# EAGLE design esp_RAMPS_1_41_Stepper_drivers (EAGLE 8.7.0)
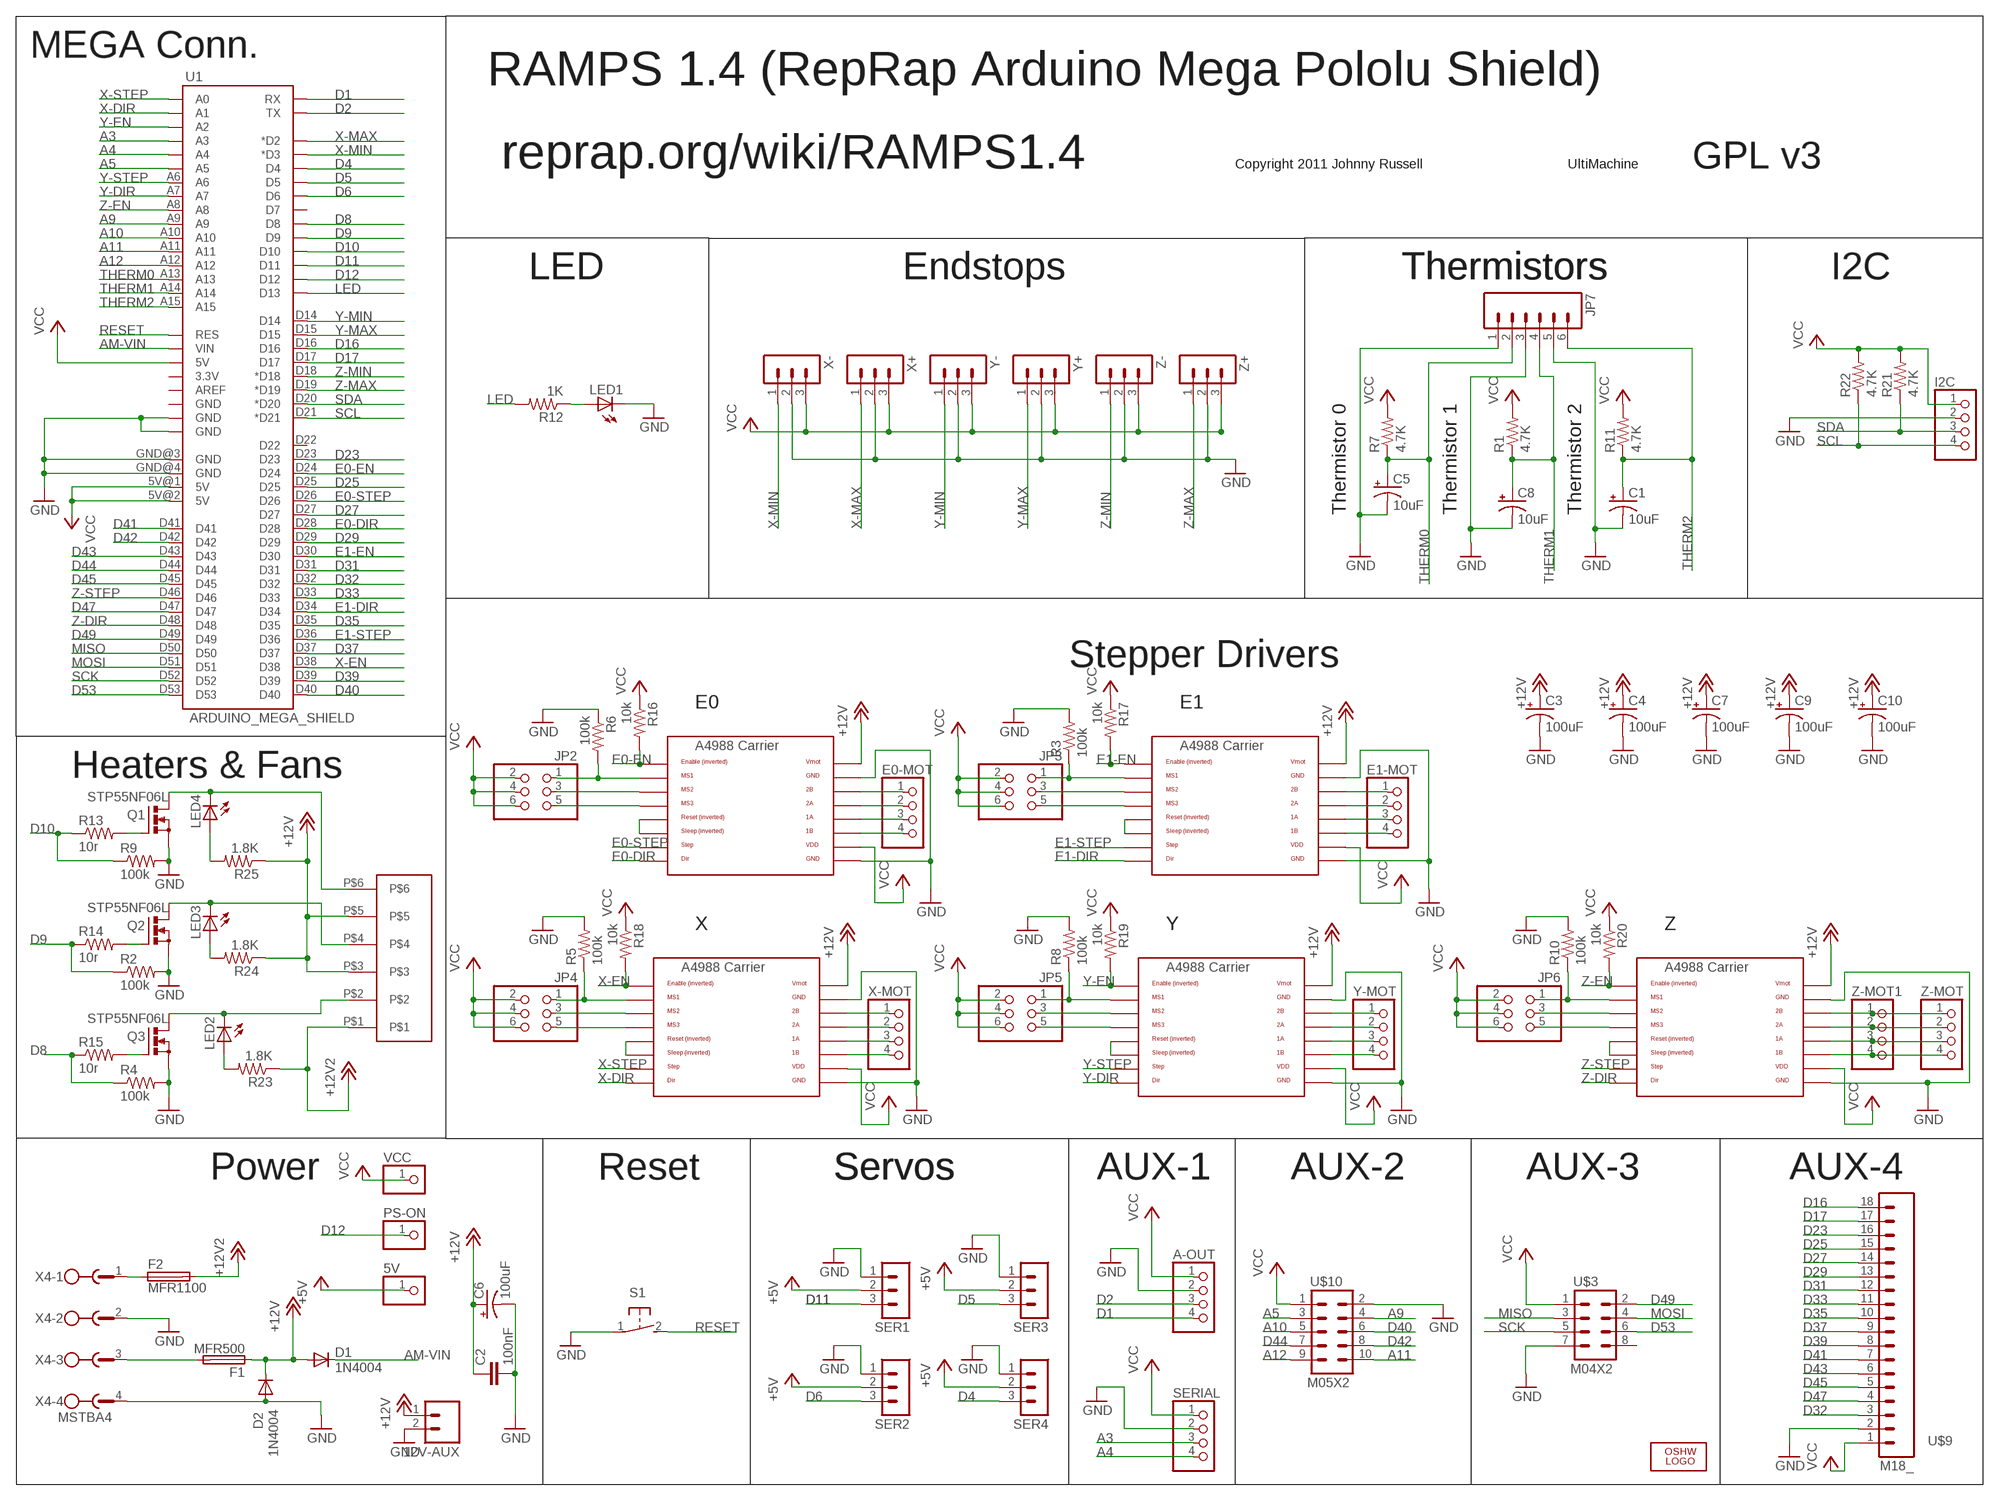
[diagram p0: schematic, sheet 1]

## Parts
5V  PINHD-1X1  [1X01]
12V-AUX  M02PTH  [1X02]
A-OUT  PINHD-1X4  [1X04]
C1  10uF  CPOL-US153CLV-0405  [153CLV-0405]
C2  100nF  C-EUC0805  [C0805]
C3  100uF  CPOL-US153CLV-0605  [153CLV-0605]
C4  100uF  CPOL-US153CLV-0605  [153CLV-0605]
C5  10uF  CPOL-US153CLV-0405  [153CLV-0405]
C6  100uF  CPOL-US153CLV-0605  [153CLV-0605]
C7  100uF  CPOL-US153CLV-0605  [153CLV-0605]
C8  10uF  CPOL-US153CLV-0405  [153CLV-0405]
C9  100uF  CPOL-US153CLV-0605  [153CLV-0605]
C10  100uF  CPOL-US153CLV-0605  [153CLV-0605]
D1  1N4004  [DO41-10]
D2  1N4004  [DO41-10]
E0-MOT  PINHD-1X4  [1X04]
E1-MOT  PINHD-1X4  [1X04]
F1  MFR500  PTCFUSE  [MFR500]
F2  MFR1100  PTCFUSEMFR1100  [MFR1100]
I2C  PINHD-1X4  [1X04]
JP2  PINHD-2X3  [2X03]
JP3  PINHD-2X3  [2X03]
JP4  PINHD-2X3  [2X03]
JP5  PINHD-2X3  [2X03]
JP6  PINHD-2X3  [2X03]
JP7  M06SIP  [1X06]
LED1  LEDCHIP-LED0805  [CHIP-LED0805]
LED2  LEDCHIP-LED0805  [CHIP-LED0805]
LED3  LEDCHIP-LED0805  [CHIP-LED0805]
LED4  LEDCHIP-LED0805  [CHIP-LED0805]
LOGO1  OSHW_LOGO_6MILX0100-NT  [OSHW_6X100_NOTEXT]
PS-ON  PINHD-1X1  [1X01]
Q1  STP55NF06L  IRF512  [TO220BV]
Q2  STP55NF06L  IRF512  [TO220BV]
Q3  STP55NF06L  IRF512  [TO220BV]
R1  4.7K  R-US_R0805  [R0805]
R2  100k  R-US_R0805  [R0805]
R3  100k  R-US_R0805  [R0805]
R4  100k  R-US_R0805  [R0805]
R5  100k  R-US_R0805  [R0805]
R6  100k  R-US_R0805  [R0805]
R7  4.7K  R-US_R0805  [R0805]
R8  100k  R-US_R0805  [R0805]
R9  100k  R-US_R0805  [R0805]
R10  100k  R-US_R0805  [R0805]
R11  4.7K  R-US_R0805  [R0805]
R12  1K  R-US_R0805  [R0805]
R13  10r  R-US_R0805  [R0805]
R14  10r  R-US_M0805  [M0805]
R15  10r  R-US_R0805  [R0805]
R16  10k  R-US_R0805  [R0805]
R17  10k  R-US_R0805  [R0805]
R18  10k  R-US_R0805  [R0805]
R19  10k  R-US_R0805  [R0805]
R20  10k  R-US_R0805  [R0805]
R21  4.7K  R-US_R0805  [R0805]
R22  4.7K  R-US_R0805  [R0805]
R23  1.8K  R-US_R0805  [R0805]
R24  1.8K  R-US_R0805  [R0805]
R25  1.8K  R-US_R0805  [R0805]
S1  31-XX  [B3F-31XX]
SER1  3PIN-HEADER  [3PIN-HEADER]
SER2  3PIN-HEADER  [3PIN-HEADER]
SER3  3PIN-HEADER  [3PIN-HEADER]
SER4  3PIN-HEADER  [3PIN-HEADER]
SERIAL  PINHD-1X4  [1X04]
U1  ARDUINO_MEGA_SHIELD  [ARDUINO_MEGA_SHIELD]
U$2  282837-6  [282837-6]
U$3  M04X2  [2X4]
U$4  A4988BREAKOUT  [A4988BREAKOUT]
U$5  A4988BREAKOUT  [A4988BREAKOUT]
U$6  A4988BREAKOUT  [A4988BREAKOUT]
U$7  A4988BREAKOUT  [A4988BREAKOUT]
U$8  A4988BREAKOUT  [A4988BREAKOUT]
U$9  M18_  [1X18]
U$10  M05X2  [2X5]
VCC  PINHD-1X1  [1X01]
X4  MSTBA4  [MSTBA4]
X+  3PIN-HEADER  [3PIN-HEADER]
X-  3PIN-HEADER  [3PIN-HEADER]
X-MOT  PINHD-1X4  [1X04]
Y+  3PIN-HEADER  [3PIN-HEADER]
Y-  3PIN-HEADER  [3PIN-HEADER]
Y-MOT  PINHD-1X4  [1X04]
Z+  3PIN-HEADER  [3PIN-HEADER]
Z-  3PIN-HEADER  [3PIN-HEADER]
Z-MOT  PINHD-1X4  [1X04]
Z-MOT1  PINHD-1X4  [1X04]

## Nets
+5V: 5V.1 SER1.2 SER2.2 SER3.2 SER4.2
+12V: 12V-AUX.1 C2.1 C3.+ C4.+ C6.+ C7.+ C9.+ C10.+ D1.A D2.C F1.1 R24.1 R25.1 U$2.P$3 U$2.P$5 U$4.VMOT U$5.VMOT U$6.VMOT U$7.VMOT U$8.VMOT
+12V2: F2.2 R23.1 U$2.P$1
A3: SERIAL.3 U1.A3
A4: SERIAL.4 U1.A4
A5: U1.A5 U$10.3
A9: U1.A9 U$10.4
A10: U1.A10 U$10.5
A11: U1.A11 U$10.10
A12: U1.A12 U$10.9
AM-VIN: D1.C U1.VIN
D1: A-OUT.4 U1.RX
D2: A-OUT.3 U1.TX
D4: SER4.3 U1.D4
D5: SER3.3 U1.D5
D6: SER2.3 U1.D6
D8: R4.1 R15.1 U1.D8
D9: R2.1 R14.1 U1.D9
D10: R9.1 R13.1 U1.D10
D11: SER1.3 U1.D11
D12: PS-ON.1 U1.D12
D16: U1.D16 U$9.18
D17: U1.D17 U$9.17
D23: U1.D23 U$9.16
D25: U1.D25 U$9.15
D27: U1.D27 U$9.14
D29: U1.D29 U$9.13
D31: U1.D31 U$9.12
D32: U1.D32 U$9.3
D33: U1.D33 U$9.11
D35: U1.D35 U$9.10
D37: U1.D37 U$9.9
D39: U1.D39 U$9.8
D40: U1.D40 U$10.6
D41: U1.D41 U$9.7
D42: U1.D42 U$10.8
D43: U1.D43 U$9.6
D44: U1.D44 U$10.7
D45: U1.D45 U$9.5
D47: U1.D47 U$9.4
D49: U1.D49 U$3.2
D53: U1.D53 U$3.6
E0-DIR: U1.D28 U$4.DIR
E0-EN: R16.2 U1.D24 U$4.EN
E0-STEP: U1.D26 U$4.STEP
E1-DIR: U1.D34 U$5.DIR
E1-EN: R17.2 U1.D30 U$5.EN
E1-STEP: U1.D36 U$5.STEP
GND: 12V-AUX.2 A-OUT.2 C1.- C2.2 C3.- C4.- C5.- C6.- C7.- C8.- C9.- C10.- D2.A I2C.2 JP7.1 JP7.3 JP7.5 LED1.C Q1.S Q2.S Q3.S R2.2 R3.2 R4.2 R5.2 R6.1 R8.2 R9.2 R10.2 S1.1(P) SER1.1 SER2.1 SER3.1 SER4.1 SERIAL.2 U1.GND@0(GND) U1.GND@1(GND) U1.GND@3(GND) U1.GND@4(GND) U$3.7 U$4.GND U$4.GND@0(GND) U$5.GND U$5.GND@0(GND) U$6.GND U$6.GND@0(GND) U$7.GND U$7.GND@0(GND) U$8.GND U$8.GND@0(GND) U$9.2 U$10.2 X4.2 X4.4 X+.2 X-.2 Y+.2 Y-.2 Z+.2 Z-.2
LED: R12.2 U1.D13
MISO: U1.D50 U$3.3
MOSI: U1.D51 U$3.4
N$1: LED3.C Q2.D U$2.P$4
N$3: E0-MOT.1 U$4.2B
N$4: E0-MOT.2 U$4.2A
N$5: JP2.1 R6.2 U$4.MS1
N$6: JP2.5 U$4.MS3
N$7: LED4.C Q1.D U$2.P$6
N$8: U$4.RST U$4.SLP(SLEEP)
N$9: JP2.3 U$4.MS2
N$10: E0-MOT.3 U$4.1A
N$11: E0-MOT.4 U$4.1B
N$12: E1-MOT.1 U$5.2B
N$13: E1-MOT.2 U$5.2A
N$14: JP4.1 R5.1 U$6.MS1
N$15: JP4.3 U$6.MS2
N$16: E1-MOT.3 U$5.1A
N$17: JP5.3 U$7.MS2
N$18: E1-MOT.4 U$5.1B
N$19: JP4.5 U$6.MS3
N$20: U$6.RST U$6.SLP(SLEEP)
N$21: U$6.2B X-MOT.1
N$22: U$6.2A X-MOT.2
N$23: U$7.RST U$7.SLP(SLEEP)
N$24: U$5.RST U$5.SLP(SLEEP)
N$25: JP3.1 R3.1 U$5.MS1
N$26: U$6.1A X-MOT.3
N$27: U$6.1B X-MOT.4
N$28: U$7.2B Y-MOT.1
N$29: U$7.2A Y-MOT.2
N$30: U$7.1A Y-MOT.3
N$31: JP5.5 U$7.MS3
N$32: LED2.A R23.2
N$33: JP5.1 R8.1 U$7.MS1
N$34: JP3.5 U$5.MS3
N$35: JP3.3 U$5.MS2
N$36: U$7.1B Y-MOT.4
N$37: JP6.3 U$8.MS2
N$38: U$8.RST U$8.SLP(SLEEP)
N$39: JP6.5 U$8.MS3
N$40: JP6.1 R10.1 U$8.MS1
N$41: U$8.2B Z-MOT1.1 Z-MOT.1
N$42: U$8.2A Z-MOT1.2 Z-MOT.2
N$43: U$8.1A Z-MOT1.3 Z-MOT.3
N$44: U$8.1B Z-MOT1.4 Z-MOT.4
N$45: LED3.A R24.2
N$46: LED1.A R12.1
N$47: Q2.G R14.2
N$48: Q1.G R13.2
N$49: Q3.G R15.2
N$50: LED4.A R25.2
N$51: LED2.C Q3.D U$2.P$2
N$53: F2.1 X4.1
N$54: F1.2 X4.3
RESET: S1.2(S) U1.RES
SCK: U1.D52 U$3.5
SCL: I2C.4 R22.1 U1.D21(*D21)
SDA: I2C.3 R21.1 U1.D20(*D20)
THERM0: C5.+ JP7.2 R7.1 U1.A13
THERM1: C8.+ JP7.4 R1.1 U1.A14
THERM2: C1.+ JP7.6 R11.1 U1.A15
VCC: A-OUT.1 I2C.1 JP2.2 JP2.4 JP2.6 JP3.2 JP3.4 JP3.6 JP4.2 JP4.4 JP4.6 JP5.2 JP5.4 JP5.6 JP6.2 JP6.4 JP6.6 R1.2 R7.2 R11.2 R16.1 R17.1 R18.1 R19.1 R20.1 R21.2 R22.2 SERIAL.1 U1.5V@0(5V) U1.5V@1(5V) U1.5V@2(5V) U$3.1 U$4.VDD U$5.VDD U$6.VDD U$7.VDD U$8.VDD U$9.1 U$10.1 VCC.1 X+.3 X-.3 Y+.3 Y-.3 Z+.3 Z-.3
X-DIR: U1.A1 U$6.DIR
X-EN: R18.2 U1.D38 U$6.EN
X-MAX: U1.D2(*D2) X+.1
X-MIN: U1.D3(*D3) X-.1
X-STEP: U1.A0 U$6.STEP
Y-DIR: U1.A7 U$7.DIR
Y-EN: R19.2 U1.A2 U$7.EN
Y-MAX: U1.D15 Y+.1
Y-MIN: U1.D14 Y-.1
Y-STEP: U1.A6 U$7.STEP
Z-DIR: U1.D48 U$8.DIR
Z-EN: R20.2 U1.A8 U$8.EN
Z-MAX: U1.D19(*D19) Z+.1
Z-MIN: U1.D18(*D18) Z-.1
Z-STEP: U1.D46 U$8.STEP
Unconnected: U1.3.3V U1.AREF U1.D7 U1.D22 U1.GND@2(GND) U$3.8

## Notes on the sheet
- MEGA Conn.
- RAMPS 1.4 (RepRap Arduino Mega Pololu Shield)
- reprap.org/wiki/RAMPS1.4 | Copyright 2011 Johnny Russell | UltiMachine | GPL v3
- LED | Endstops | Thermistors | Thermistors | I2C
- Thermistor 0 | Thermistor 1 | Thermistor 2
- Stepper Drivers
- E0 | E1
- Heaters & Fans
- X | Y | Z
- Power | Reset | Servos | Servos | AUX-1 | AUX-2 | AUX-3 | AUX-4

## Library data of the parts
5V PS-ON VCC = adafruit:PINHD-1X1: Pin header 1x1 for 0.1" spacing With round pins
12V-AUX = SparkFun:M02: Header 2 Standard 2-pin 0.1" header. Use with straight break away headers (SKU : PRT-00116), right angle break away headers (PRT-00553), swiss pins (PRT-00743), machine pins (PRT-00117), and female headers (PRT-00115). Molex polarized connector foot print use with SKU : PRT-08233 with associated crimp pins and housings.
A-OUT E0-MOT E1-MOT I2C SERIAL X-MOT Y-MOT Z-MOT Z-MOT1 = RepRapjr:PINHD-1X4: PIN HEADER
C1 C3-C10 = adafruit:CPOL-US: POLARIZED CAPACITOR, American symbol
C2 = resistor:C-EU: CAPACITOR, European symbol
D1 D2 = diode:1N4004: DIODE general purpose rectifier, 1 A
F1 F2 = RepRapjr:PTCFUSE: LITTLEFUSE Picofuse/slow Littlefuse
JP2-JP6 = pinhead:PINHD-2X3: PIN HEADER
JP7 = SparkFun:M06: Header 6 Standard 6-pin 0.1" header. Use with straight break away headers (SKU : PRT-00116), right angle break away headers (PRT-00553), swiss pins (PRT-00743), machine pins (PRT-00117), and female headers (PRT-00115). Molex polarized connector foot print use with SKU : PRT-08094 with associated crimp pins and housings. NOTES ON THE VARIANTS LOCK and LOCK_LONGPADS... This footprint was designed to help hold the alignment of a through-hole component (i.e. 6-pin header) while soldering it into place. You may notice that each hole has been shifted either up or down by 0.005 of an inch from it's more standard position (which is a perfectly straight line). This slight alteration caused the pins (the squares in the middle) to touch the edges of the holes. Because they are alternating, it causes a "brace" to hold the component in place. 0.005 has proven to be the perfect amount of "off-center" position when using our standard breakaway headers. Although looks a little odd when you look at the bare footprint, once you have a header in there, the alteration is very hard to notice. Also, if you push a header all the way into place, it is covered up entirely on the bottom side. This idea of altering the position of holes to aid alignment will be further integrated into the Sparkfun Library for other footprints. It can help hold any component with 3 or more connection pins.
LED1-LED4 = led:LED: LED OSRAM: - CHIPLED LG R971, LG N971, LY N971, LG Q971, LY Q971, LO R971, LY R971 LH N974, LH R974 LS Q976, LO Q976, LY Q976 LO Q996 - Hyper CHIPLED LW Q18S LB Q993, LB Q99A, LB R99A - SideLED LS A670, LO A670, LY A670, LG A670, LP A670 LB A673, LV A673, LT A673, LW A673 LH A674 LY A675 LS A676, LA A676, LO A676, LY A676, LW A676 LS A679, LY A679, LG A679 - Hyper Micro SIDELED® LS Y876, LA Y876, LO Y876, LY Y876 LT Y87S - SmartLED LW L88C, LW L88S LB L89C, LB L89S, LG L890 LS L89K, LO L89K, LY L89K LS L896, LA L896, LO L896, LY L896 - TOPLED LS T670, LO T670, LY T670, LG T670, LP T670 LSG T670, LSP T670, LSY T670, LOP T670, LYG T670 LG T671, LOG T671, LSG T671 LB T673, LV T673, LT T673, LW T673 LH T674 LS T676, LA T676, LO T676, LY T676, LB T676, LH T676, LSB T676, LW T676 LB T67C, LV T67C, LT T67C, LS T67K, LO T67K, LY T67K, LW E67C LS E67B, LA E67B, LO E67B, LY E67B, LB E67C, LV E67C, LT E67C LW T67C LS T679, LY T679, LG T679 LS T770, LO T770, LY T770, LG T770, LP T770 LB T773, LV T773, LT T773, LW T773 LH T774 LS E675, LA E675, LY E675, LS T675 LS T776, LA T776, LO T776, LY T776, LB T776 LHGB T686 LT T68C, LB T68C - Hyper Mini TOPLED® LB M676 - Mini TOPLED Santana® LG M470 LS M47K, LO M47K, LY M47K Source: http://www.osram.convergy.de LUXEON: - LUMILED® LXK2-PW12-R00, LXK2-PW12-S00, LXK2-PW14-U00, LXK2-PW14-V00 LXK2-PM12-R00, LXK2-PM12-S00, LXK2-PM14-U00 LXK2-PE12-Q00, LXK2-PE12-R00, LXK2-PE12-S00, LXK2-PE14-T00, LXK2-PE14-U00 LXK2-PB12-K00, LXK2-PB12-L00, LXK2-PB12-M00, LXK2-PB14-N00, LXK2-PB14-P00, LXK2-PB14-Q00 LXK2-PR12-L00, LXK2-PR12-M00, LXK2-PR14-Q00, LXK2-PR14-R00 LXK2-PD12-Q00, LXK2-PD12-R00, LXK2-PD12-S00 LXK2-PH12-R00, LXK2-PH12-S00 LXK2-PL12-P00, LXK2-PL12-Q00, LXK2-PL12-R00 Source: www.luxeon.com KINGBRIGHT: KA-3528ASYC Source: www.kingbright.com
LOGO1 = OSHW:OSHW_LOGO_6MIL
Q1-Q3 = transistor-power:IRF512: N-CHANNEL MOS FET
R1-R12 R16-R25 = adafruit:R-US_: RESISTOR, American symbol
R13-R15 = resistor:R-US_: RESISTOR, American symbol
S1 = switch-omron:31-XX: OMRON SWITCH; MPN: B3F-3100; OC_FARNELL: 959704; OC_NEWARK: 36M3582
SER1-SER4 X+ X- Y+ Y- Z+ Z- = ultimachine:3PIN-HEADER: PIN HEADER
U1 = RepRapjr:ARDUINO_MEGA_SHIELD
U$2 = RepRapjr:282837-6
U$3 = SparkFun:M04X2
U$4-U$8 = RepRapjr:A4988BREAKOUT
U$9 = SparkFun:M18
U$10 = RepRapjr:M05X2
X4 = con-phoenix-508:MSTBA4: PHOENIX

## Board
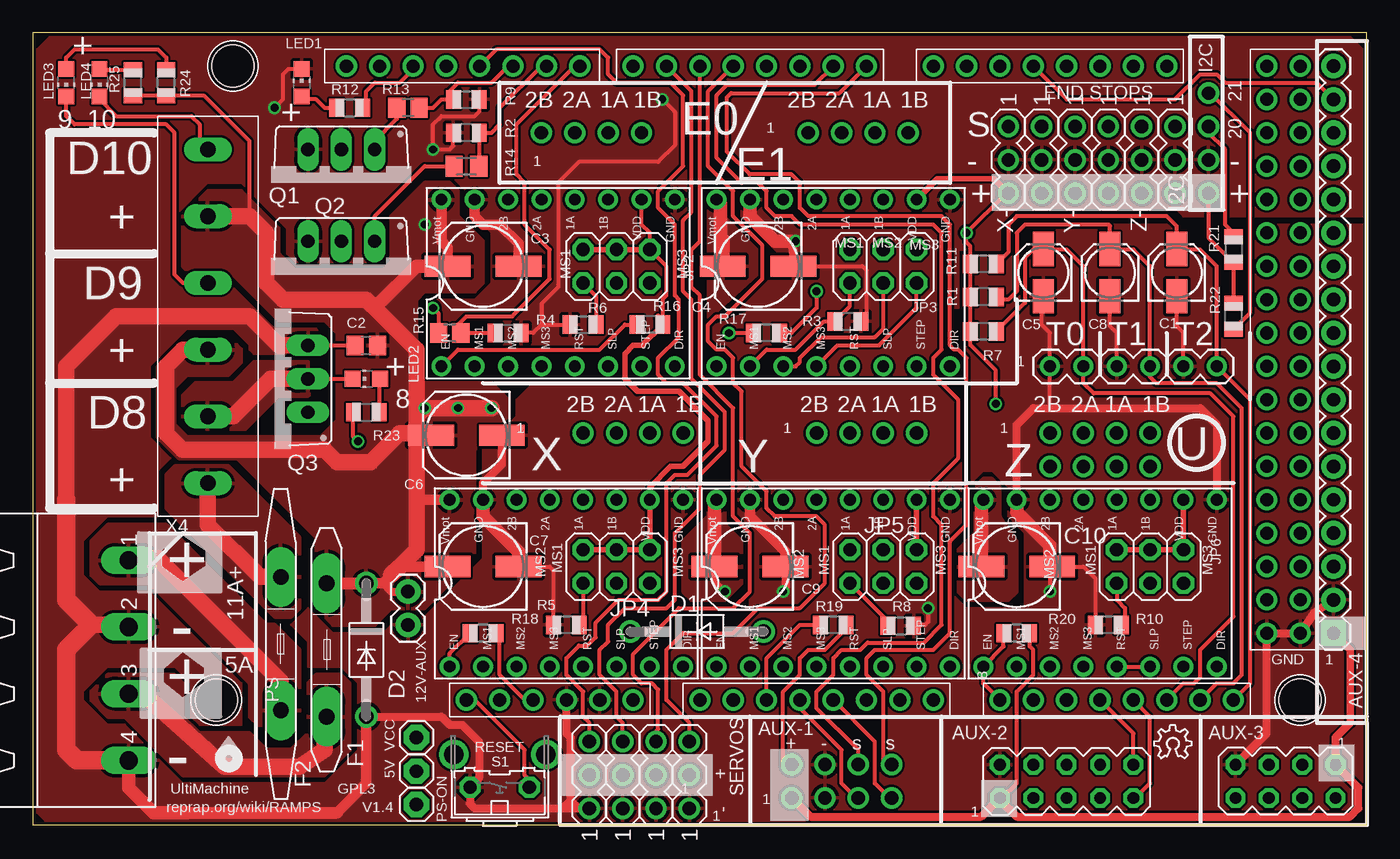
[diagram p1: board, top side]
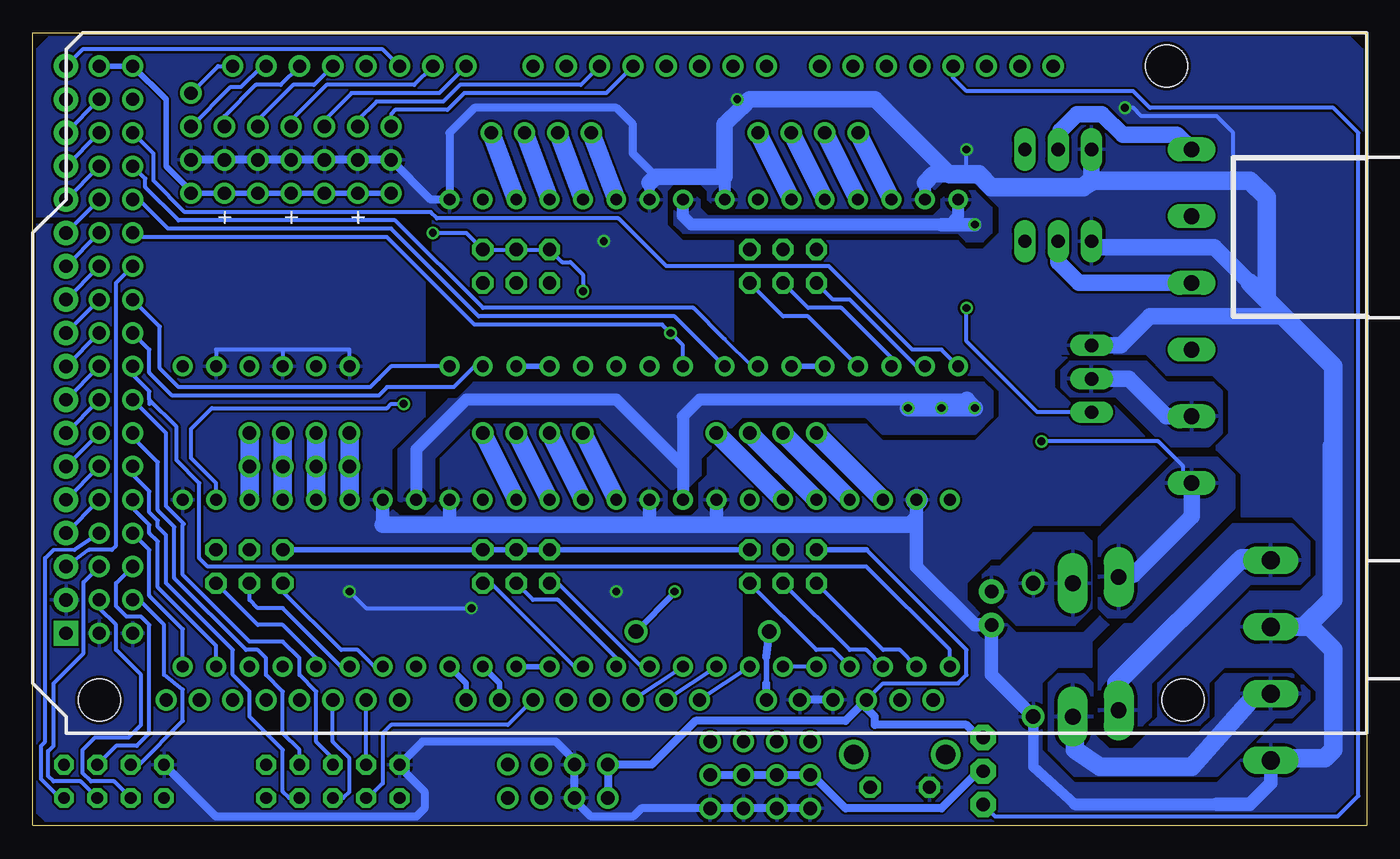
[diagram p2: board, bottom side, seen from below]

Size 101.59 x 60.31 mm. Coordinates in mm from the lower left corner, seen from the top.
Outline: 101.59,0 101.59,60.31 0,60.31 0,0 101.59,0
Copper layers (1*16): Top 0.035mm / dielectric 1.5mm / Bottom 0.035mm
Design rules "GoldPhoenix": minimum track width 7mil, minimum drill 15mil, track to track 7mil, track to pad 7mil, pad to pad 7mil, via to via 7mil, smd to smd 7mil, copper to edge 10mil, drill to drill 8mil, minimum pad ring 12mil, minimum via ring 7mil, stop-mask expansion 4mil, vias tented up to drill 25mil, thermal gap 10mil

### Footprints (pad centres in the part's own frame; a part is rotated, then mirrored left to right if it is on the bottom)
1X01 = drill 1.016 pad 1.93 octagon: 1 0,0
1X02 = drill 1.016 pad 1.88: 1 0,0; 2 2.54,0
1X04 = drill 1.016: 1 -2.54,0; 2 0,0; 3 2.54,0; 4 5.08,0
153CLV-0405 = smd 2.6 x 1.6: + 1.8,0; - -1.8,0
C0805 = smd 1.3 x 1.5: 1 -0.85,0; 2 0.85,0
153CLV-0605 = smd 3.5 x 1.6: + 2.7,0; - -2.7,0
DO41-10 = drill 1.118: A 5.08,0; C -5.08,0
MFR500 = drill 1.2 pad 2.3 long: 1 -5.08,0; 2 5.08,0
MFR1100 = drill 1.2 pad 2.3 long: 1 -5.08,0; 2 5.08,0
2X03 = drill 1.016 octagon: 1 -2.54,-1.27; 2 -2.54,1.27; 3 0,-1.27; 4 0,1.27; 5 2.54,-1.27; 6 2.54,1.27
1X06 = drill 0.9 pad 1.422: 1 0,0; 2 2.54,0; 3 5.08,0; 4 7.62,0; 5 10.16,0; 6 12.7,0
CHIP-LED0805 = smd 1.2 x 1.2: A 0,-1.05; C 0,1.05
TO220BV = drill 1.016 long: D 0,-2.54; G -2.54,-2.54; S 2.54,-2.54
R0805 = smd 1.1 x 1.4: 1 -1,0; 2 1,0
R0805' = smd 1.3 x 1.5: 1 -0.85,0; 2 0.85,0
M0805 = smd 1.3 x 1.6: 1 -0.95,0; 2 0.95,0
B3F-31XX = drill 1.016 octagon: 1 -2.261,-1.245; 2 2.261,-1.245 | drill 1.499 pad 2.159: 3 -3.505,1.245; 4 3.505,1.245
3PIN-HEADER = drill 1.016: 1 -2.54,0; 2 0,0; 3 2.54,0
ARDUINO_MEGA_SHIELD = drill 1 pad 1.422: 3.3V 35.56,2.54; 5V@0 38.1,2.54; 5V@1 93.98,50.8; 5V@2 96.52,50.8; A0 50.8,2.54; A1 53.34,2.54; A2 55.88,2.54; A3 58.42,2.54; A4 60.96,2.54; A5 63.5,2.54; A6 66.04,2.54; A7 68.58,2.54; A8 73.66,2.54; A9 76.2,2.54; A10 78.74,2.54; A11 81.28,2.54; A12 83.82,2.54; A13 86.36,2.54; A14 88.9,2.54; A15 91.44,2.54; AREF 23.876,50.8; D2 58.42,50.8; D3 55.88,50.8; D4 53.34,50.8; D5 50.8,50.8; D6 48.26,50.8; D7 45.72,50.8; D8 41.656,50.8; D9 39.116,50.8; D10 36.576,50.8; D11 34.036,50.8; D12 31.496,50.8; D13 28.956,50.8; D14 68.58,50.8; D15 71.12,50.8; D16 73.66,50.8; D17 76.2,50.8; D18 78.74,50.8; D19 81.28,50.8; D20 83.82,50.8; D21 86.36,50.8; D22 93.98,48.26; D23 96.52,48.26; D24 93.98,45.72; D25 96.52,45.72; D26 93.98,43.18; D27 96.52,43.18; D28 93.98,40.64; D29 96.52,40.64; D30 93.98,38.1; D31 96.52,38.1; D32 93.98,35.56; D33 96.52,35.56; D34 93.98,33.02; D35 96.52,33.02; D36 93.98,30.48; D37 96.52,30.48; D38 93.98,27.94; D39 96.52,27.94; D40 93.98,25.4; D41 96.52,25.4; D42 93.98,22.86; D43 96.52,22.86; D44 93.98,20.32; D45 96.52,20.32; D46 93.98,17.78; D47 96.52,17.78; D48 93.98,15.24; D49 96.52,15.24; D50 93.98,12.7; D51 96.52,12.7; D52 93.98,10.16; D53 96.52,10.16; GND@0 40.64,2.54; GND@1 43.18,2.54; GND@2 26.416,50.8; GND@3 93.98,7.62; GND@4 96.52,7.62; RES 33.02,2.54; RX 63.5,50.8; TX 60.96,50.8; VIN 45.72,2.54 | hole 3.2: 96.52,2.54; 13.97,2.54; 15.24,50.8
282837-6 = drill 1.2 long: P$1 0,-12.7; P$2 0,-7.62; P$3 0,-2.54; P$4 0,2.54; P$5 0,7.62; P$6 0,12.7
2X4 = drill 0.9 pad 1.422 octagon: 1 -3.81,-1.27; 2 -3.81,1.27; 3 -1.27,-1.27; 4 -1.27,1.27; 5 1.27,-1.27; 6 1.27,1.27; 7 3.81,-1.27; 8 3.81,1.27
A4988BREAKOUT = drill 0.9: 1A 8.89,1.27; 1B 11.43,1.27; 2A 6.35,1.27; 2B 3.81,1.27; DIR 16.51,-11.43; EN -1.27,-11.43; GND 16.51,1.27; GND@0 1.27,1.27; MS1 1.27,-11.43; MS2 3.81,-11.43; MS3 6.35,-11.43; RST 8.89,-11.43; SLP 11.43,-11.43; STEP 13.97,-11.43; VDD 13.97,1.27; VMOT -1.27,1.27
1X18 = drill 1.016 pad 1.88 square: 1 0,0 | drill 1.016 pad 1.88: 2 2.54,0; 3 5.08,0; 4 7.62,0; 5 10.16,0; 6 12.7,0; 7 15.24,0; 8 17.78,0; 9 20.32,0; 10 22.86,0; 11 25.4,0; 12 27.94,0; 13 30.48,0; 14 33.02,0; 15 35.56,0; 16 38.1,0; 17 40.64,0; 18 43.18,0
2X5 = drill 0.9 pad 1.422 octagon: 1 -3.81,-1.27; 2 -3.81,1.27; 3 -1.27,-1.27; 4 -1.27,1.27; 5 1.27,-1.27; 6 1.27,1.27; 7 3.81,-1.27; 8 3.81,1.27; 9 6.35,-1.27; 10 6.35,1.27
MSTBA4 = drill 1.397 long: 1 -7.62,5.08; 2 -2.54,5.08; 3 2.54,5.08; 4 7.62,5.08

### Placement (x,y rotation side)
5V  29.21,4.1 0 top
12V-AUX  28.57,17.78 270 top
A-OUT  60.33,4.6 0 top
C1  87.12,42.06 90 top
C2  25.4,36.51 180 top
C3  34.29,42.54 180 top
C4  55.24,42.54 180 top
C5  76.96,42.06 90 top
C6  33.02,29.69 180 top
C7  34.29,19.69 180 top
C8  82.04,42.06 90 top
C9  54.61,19.69 180 top
C10  74.93,19.69 180 top
D1  50.57,14.73 0 top
D2  25.4,13.33 270 top
E0-MOT  41.27,52.7 0 top
E1-MOT  61.59,52.7 0 top
F1  22.38,13.33 270 top
F2  18.89,13.81 90 top
I2C  89.53,50.64 90 top
JP2  44.45,42.54 0 top
JP3  64.77,42.54 0 top
JP4  44.45,19.69 0 top
JP5  64.77,19.69 0 top
JP6  85.09,19.69 0 top
JP7  77.47,34.92 0 top
LED1  20.48,56.51 0 top
LED2  25.4,33.97 90 top
LED3  2.54,56.51 180 top
LED4  5.08,56.51 180 top
LOGO1  85.41,5.08 0 top
PS-ON  29.21,1.56 0 top
Q1  23.49,48.89 180 top
Q2  23.49,41.91 180 top
Q3  18.42,33.97 90 top
R1  72.39,40.22 180 top
R2  33.02,52.7 180 top
R3  62.08,38.35 0 top
R4  36.2,37.46 0 top
R5  40.64,15.24 180 top
R6  41.91,38.1 0 top
R7  72.39,37.58 180 top
R8  66.1,15.18 0 top
R9  33.02,55.24 0 top
R10  81.92,15.24 180 top
R11  72.39,42.7 180 top
R12  24.13,54.61 0 top
R13  10r  [R0805']  28.57,54.61 180 top
R14  33.02,50.16 180 top
R15  10r  [R0805']  31.75,37.46 180 top
R16  46.99,38.1 180 top
R17  55.88,37.46 180 top
R18  34.29,14.6 180 top
R19  60.96,15.24 180 top
R20  74.93,14.6 180 top
R21  91.44,43.81 270 top
R22  91.44,38.73 90 top
R23  25.4,31.43 0 top
R24  10.16,56.51 90 top
R25  7.62,56.51 90 top
S1  35.56,4.13 0 top
SER1  42.39,3.81 90 top
SER2  44.93,3.81 90 top
SER3  47.47,3.81 90 top
SER4  50.01,3.81 90 top
SERIAL  60.33,2.06 0 top
U1  0,6.98 0 top
U$2  13.34,38.73 0 top
U$3  95.41,3.33 180 top
U$4  32.38,46.35 0 top
U$5  53.34,46.35 0 top
U$6  33.02,23.49 0 top
U$7  53.34,23.49 0 top
U$8  73.66,23.49 0 top
U$9  99.06,14.6 90 top
U$10  77.47,3.33 0 top
VCC  29.21,6.67 0 top
X4  2.22,12.54 270 top
X+  76.83,50.64 270 top
X-  74.3,50.64 270 top
X-MOT  44.45,29.84 0 top
Y+  81.92,50.64 270 top
Y-  79.38,50.64 270 top
Y-MOT  62.23,29.84 0 top
Z+  87,50.64 270 top
Z-  84.45,50.64 270 top
Z-MOT  80.01,29.84 0 top
Z-MOT1  80.01,27.3 0 top

### Tracks (layer width: path | path; a pad name or v marks a point on that pad's centre or on a via)
+5V
  Bottom 0.61: SER4.2 SER3.2 SER2.2 | SER2.2 SER1.2 42.23,3.81 39.69,1.27 32.38,1.27 29.55,4.1 5V.1 | SER2.2
+12V  (via drill 0.6)
  Top 0.305: R25.1 R24.1 13.06,55.52 16.51,52.07 16.51,46.35
  Top 0.406: C9.+ 51.91,18.57 v52.7,17.78
  Top 0.61: 12V-AUX.1 27.3,17.78 26.67,18.41
  Top 0.813: D2.C 26.67,18.41 27.3,19.05 | 27.94,19.69 C7.+ | U$6.VMOT | C3.+ 31.59,43.97 31.11,44.45 U$4.VMOT | 29.21,24.77 U$6.VMOT | 29.21,24.77
  Top 0.914: F1.1 D2.C
  Top 1.016: C9.+ 51.91,24.6 U$7.VMOT | C10.+ 72.23,24.6 U$8.VMOT | C4.+ 52.55,44.61 52.39,44.77 52.39,47.31 U$5.VMOT | C3.+ 29.21,42.54 26.19,39.53 25.88,39.53
  Top 1.27: 27.3,19.05 27.94,19.69 29.21,20.95 29.21,24.77 29.21,31.11 | U$2.P$5 16.51,46.35 17.78,45.09 17.78,41.27 19.05,40 25.4,40 25.88,39.53 29.21,36.2 29.21,31.11 | 29.21,31.11 v29.84,31.75 v32.38,31.75 v34.92,31.75 | C6.+ 30.16,29.84 27.94,29.84 25.72,27.62 23.18,27.62 22.23,28.57 11.43,28.57 10.16,29.84 10.16,34.92 11.43,36.2 U$2.P$3
  Bottom 0.406: v52.7,17.78 52.7,17.68 D1.A
  Bottom 0.914: U$4.VMOT 31.11,46.35 31.75,45.72 32.38,45.72 51.44,45.72 52.07,46.35 U$5.VMOT | U$8.VMOT 72.39,28.57 68.58,32.38 57.15,32.38 52.07,27.3 | 52.07,27.3 U$7.VMOT | 52.07,27.3 52.07,31.11 50.8,32.38 30.45,32.38
  Bottom 1.016: 32.38,45.72 v29.84,45.72
  Bottom 1.27: 30.45,32.38 30.45,32.35 v29.84,31.75 v34.92,31.75 | U$6.VMOT
  pour Top: 21.59,21.91 21.59,16.51 22.86,15.24 26.04,15.24 27.3,16.51 29.84,16.51 33.66,20.32 33.66,28.57 36.2,31.11 36.2,32.38 34.92,33.65 29.84,33.65 29.21,34.29 29.21,40 29.84,40.64 33.66,40.64 34.29,41.27 34.29,44.45 32.38,46.35 32.38,48.26 31.75,48.89 29.84,48.89 27.3,46.35 27.3,42.86 26.67,42.23 20,42.23 18.73,43.5 18.73,45.4 15.88,48.26 13.34,48.26 11.43,46.35 11.43,42.54 12.06,41.91 15.24,41.91 18.73,38.42 22.23,38.42 23.18,37.46 23.18,30.8 21.91,29.53 11.75,29.53 10.79,30.48 10.79,33.34 11.75,34.29 14.92,34.29 15.88,35.24 15.88,36.2 15.24,36.83 11.43,36.83 9.53,34.92 9.53,29.53 11.11,27.94 15.56,27.94
  pour Bottom: 28.57,33.02 28.57,31.11 29.84,29.84 36.83,29.84 38.1,31.11 47.62,31.11 50.8,27.94 50.8,26.67 52.07,25.4 52.7,25.4 58.42,31.11 67.94,31.11 71.12,27.94 71.12,24.77 71.75,24.13 73.03,24.13 73.66,24.77 73.66,28.57 69.85,32.38 69.22,32.38 67.94,33.65 29.21,33.65
  pour Top: 51.44,24.13 51.44,23.49 49.53,21.59 49.53,17.78 50.16,17.14 52.7,17.14 53.98,18.41 53.98,21.59 52.7,22.86 52.7,24.13 52.07,24.77
  pour Top: 71.75,25.72 71.75,22.23 70.48,20.95 70.48,17.78 71.12,17.14 74.3,17.14 74.93,17.78 74.93,21.59 73.66,23.49 73.66,25.72 73.03,26.35 72.39,26.35
  pour Top: 51.44,48.26 51.44,38.42 55.24,41.91 55.24,43.81 52.7,46.35 52.7,47.62 52.07,48.26
  pour Bottom: 28.57,46.35 28.57,46.99 29.84,48.26 31.75,48.26 32.38,47.62 32.38,46.99 33.02,46.35 50.16,46.35 50.8,46.99 50.8,47.62 51.44,48.26 52.07,48.26 52.7,47.62 52.7,45.72 52.07,45.09 31.11,45.09 30.48,44.45 29.21,44.45 28.57,45.09
  pour Bottom: 20.95,21.59 20.95,16.51 22.23,15.24 26.67,15.24 29.21,17.78 29.21,19.05 28.57,19.69 27.94,19.69 25.4,22.23 21.59,22.23
+12V2  (via drill 0.6)
  Top 0.305: F2.2 19.05,19.05 | R23.1 24.4,29.57 v24.77,29.21
  Top 1.27: U$2.P$1 13.34,22.86 17.3,18.89 F2.2
  Bottom 0.305: v24.77,29.21 15.88,29.21 13.97,27.3 13.97,26.67 U$2.P$1
  Bottom 1.27: U$2.P$1 13.34,23.49 17.78,19.05 19.05,19.05
  pour Top: 10.16,26.67 10.16,24.13 18.41,15.87 19.68,15.87 20.32,16.51 20.32,21.91 14.92,27.3 10.79,27.3
  pour Bottom: 10.16,26.67 10.16,24.13 18.41,15.87 19.68,15.87 20.32,16.51 20.32,21.91 14.29,27.94 11.43,27.94
A3
  Top 0.305: U1.A3 58.42,8.89 61.59,5.71 61.59,3.17 62.71,2.06 SERIAL.3
A4
  Top 0.305: U1.A4 64.14,6.35 64.14,3.17 65.25,2.06 SERIAL.4
A5
  Bottom 0.305: U1.A5 65.41,7.62 74.3,7.62 74.93,6.98 74.93,3.17 76.04,2.06 U$10.3
A9
  Bottom 0.305: U$10.4 U1.A9
A10
  Bottom 0.305: U1.A10 78.74,6.35 77.47,5.08 77.47,2.54 77.95,2.06 U$10.5
A11
  Top 0.305: U$10.10 83.82,6.98 U1.A11
A12
  Top 0.305: U1.A12 85.09,8.26 85.09,3.17 83.98,2.06 U$10.9
AM-VIN
  Bottom 0.406: 45.72,10.79 45.72,12.81
  Bottom 0.61: 45.72,12.81 D1.C | U1.VIN 45.72,10.79
D1
  Top 0.305: U1.RX 61.44,55.72 53.18,55.72 52.86,55.4 52.86,51.28 54.61,49.53 57.78,49.53 58.42,48.89 58.42,46.99 59.05,46.35 69.22,46.35 69.85,45.72 69.85,36.51 70.17,36.2 70.48,36.2 71.12,35.56 71.12,22.86 69.85,21.59 69.85,14.6 68.58,13.33 64.14,13.33 63.5,12.7 63.5,11.43 64.77,10.16 64.77,4.6 A-OUT.4
D2
  Top 0.305: U1.TX 59.53,56.36 52.86,56.36 52.07,55.56 52.07,50.8 53.98,48.89 55.24,48.89 55.88,48.26 55.88,46.99 56.52,46.35 57.78,46.35 58.42,45.72 68.58,45.72 69.22,45.09 69.22,36.2 68.58,35.56 68.58,34.29 70.48,32.38 70.48,27.94 68.58,26.03 68.58,23.49 69.22,22.86 69.22,15.24 67.87,13.89 63.58,13.89 63.02,13.33 61.59,13.33 60.96,12.7 60.96,11.43 59.69,10.16 59.69,8.89 62.87,5.71 A-OUT.3
D4
  Top 0.305: U1.D4 51.44,55.88 51.44,50.16 53.34,48.26 53.34,46.35 55.56,44.13 55.56,41.59 52.7,38.73 52.07,38.73 51.44,38.1 51.44,36.83 52.07,36.2 52.7,36.2 53.34,35.56 53.34,33.65 53.98,33.02 53.98,27.3 55.88,25.4 55.88,24.13 56.52,23.49 59.69,23.49 60.33,22.86 60.33,18.41 58.42,16.51 55.24,16.51 53.34,14.6 49.53,14.6 48.26,13.33 48.26,9.53 50.01,7.78 SER4.3
D5
  Top 0.305: SER3.3 47.47,7.14 47.62,7.3 47.62,10.32 47.15,10.79 46.35,10.79 45.72,11.43 45.72,13.02 49.21,16.51 53.34,16.51 54.61,17.78 54.61,22.23 53.34,23.49 53.34,31.75 50.8,34.29 50.8,40.32 50.16,40.96 50.16,43.81 50.8,44.45 U1.D5
D6
  Top 0.305: U1.D6 50.16,55.88 50.16,46.67 49.53,46.04 49.53,40.64 50.16,40 50.16,33.97 52.7,31.43 52.7,28.57 50.8,26.67 50.8,24.13 48.9,22.23 48.9,17.14 48.26,16.51 45.09,16.51 43.81,15.24 43.81,13.97 43.18,13.33 43.18,11.43 44.45,10.16 44.45,8.26 44.93,7.78 SER2.3
D8
  Top 0.305: U1.D8 41.27,57.79 36.83,53.34 36.83,49.53 37.47,48.89 37.47,45.72 39.37,43.81 39.37,41.59 36.51,38.73 33.02,38.73 32.38,38.1 32.38,37.68 R15.1 R4.1
D9
  Top 0.305: U1.D9 38.73,57.79 35.56,54.61 35.56,53.34 34.92,52.7 R2.1 34.02,50.21 R14.1
D10
  Top 0.305: U1.D10 36.2,57.79 34.92,56.51 32.38,56.51 31.75,55.88 31.75,55.52 R9.1 31.11,55.24 30.48,54.61 R13.1
D11
  Top 0.305: SER1.3 42.39,7.78 41.91,8.26 41.91,10.16 40.64,11.43 40.64,12.7 41.59,13.65 42.23,13.65 42.86,14.29 42.86,15.4 44.61,17.14 47.62,17.14 48.26,17.78 48.26,26.03 48.9,26.67 49.85,26.67 52.07,28.89 52.07,31.11 49.53,33.65 48.26,33.65 47.62,34.29 47.62,35.56 49.21,37.15 49.21,40 48.9,40.32 48.9,45.72 47.62,46.99 47.62,48.26 49.53,50.16 49.53,55.56 48.58,56.51 44.45,56.51 43.81,57.15 43.81,58.42 43.18,59.05 35.31,59.05 U1.D11
D12
  Bottom 0.305: U1.D12 31.5,56.9 30.48,55.88 17.78,55.88 16.51,54.61 2.54,54.61 0.64,52.7 0.64,2.22 2.22,0.63 28.28,0.63 PS-ON.1
D16
  Bottom 0.305: U$9.18 97.79,59.05 74.93,59.05 U1.D16 | U$9.18
D17
  Top 0.305: U$9.17 97.79,56.51 90.81,56.51 90.17,57.15 88.9,57.15 87,55.24 78.74,55.24 U1.D17 | U$9.17
D23
  Bottom 0.305: U$9.16 U1.D23 | U$9.16
D25
  Bottom 0.305: U$9.15 U1.D25 | U$9.15
D27
  Bottom 0.305: U$9.14 U1.D27 | U$9.14
D29
  Bottom 0.305: U$9.13 U1.D29 | U$9.13
D31
  Bottom 0.305: U$9.12 U1.D31 | U$9.12
D32
  Bottom 0.305: U1.D32 95.25,41.27 95.25,21.27 95.57,20.95 97.31,20.95 U$9.3
D33
  Bottom 0.305: U$9.11 U1.D33 | U$9.11
D35
  Bottom 0.305: U$9.10 U1.D35 | U$9.10
D37
  Bottom 0.305: U$9.9 U1.D37 | U$9.9
D39
  Bottom 0.305: U$9.8 U1.D39
D40
  Bottom 0.305: U1.D40 91.44,29.84 91.44,24.29 90.09,22.94 90.17,22.86 90.17,19.05 85.09,13.97 82.55,13.97 81.28,12.7 81.28,11.43 80.01,10.16 80.01,6.35 78.74,5.08 U$10.6
D41
  Bottom 0.305: U$9.7 U1.D41 | U$9.7
D42
  Bottom 0.305: U1.D42 93.98,29.53 92.08,27.62 92.08,23.97 90.81,22.7 90.81,18.8 85.34,13.33 84.45,13.33 83.82,12.7 83.82,11.43 82.55,10.16 82.55,6.98 81.28,5.71 U$10.8
D43
  Bottom 0.305: U$9.6 U1.D43 | U$9.6
D44
  Bottom 0.305: U1.D44 93.98,26.67 92.71,25.4 92.71,23.81 92.08,23.18 92.08,22.7 91.44,22.07 91.44,18.41 86.36,13.33 86.36,11.43 85.09,10.16 85.09,8.26 82.55,5.71 82.55,2.54 82.07,2.06 U$10.7
D45
  Bottom 0.305: U$9.5 U1.D45 | U$9.5
D47
  Bottom 0.305: U$9.4 U1.D47 | U$9.4
D49
  Bottom 0.254: 100.01,20.95 98.42,20.95
  Bottom 0.305: U$3.2 99.54,2.06 100.97,3.49 100.97,6.03 100.65,6.35 100.65,20.32 100.01,20.95 | 98.42,20.95 U1.D49
D53
  Bottom 0.305: U1.D53 96.52,16.51 95.25,15.24 95.25,13.33 93.34,11.43 93.34,7.62 94.3,6.67 96.84,6.67 97.79,5.71 97.79,3.96 97.16,3.33 95.4,3.33 U$3.6
E0-DIR
  Bottom 0.305: U1.D28 93.5,47.62 91.28,45.4 74.3,45.4 67.63,38.73 52.7,38.73 U$4.DIR
E0-EN
  Top 0.305: R16.2 45.09,38.1 43.18,36.2 32.38,36.2 U$4.EN
  Bottom 0.305: U1.D24 92.39,51.12 92.39,49.05 90.01,46.67 71.28,46.67 70.8,46.2 56.99,46.2 53.34,42.54 40.96,42.54 34.61,36.2 32.38,36.2 U$4.EN
E0-STEP
  Bottom 0.254: 48.9,36.99 46.83,34.92 U$4.STEP
  Bottom 0.305: U1.D26 93.03,49.21 93.03,48.58 90.49,46.04 73.98,46.04 67.31,39.37 51.28,39.37 48.9,36.99
E1-DIR
  Bottom 0.305: U1.D34 91.92,37.94 91.92,34.77 90.49,33.34 75.88,33.34 75.25,33.97 74.3,34.92 U$5.DIR
E1-EN  (via drill 0.6)
  Top 0.305: v53.02,37.46 R17.2
  Bottom 0.305: U1.D30 93.66,44.77 74.61,44.77 67.94,38.1 53.66,38.1 v53.02,37.46 52.07,36.51 U$5.EN
E1-STEP
  Bottom 0.305: U1.D36 92.71,36.2 92.71,34.45 90.96,32.7 75.25,32.7 74.61,33.34 69.53,33.34 67.94,34.92 U$5.STEP
GND  (via drill 0.6)
  Top 0.305: R9.2 34.02,54.34 33.66,53.97 31.11,53.97 30.48,53.34 v30.48,51.43 31.75,51.43 32.02,51.7 R2.2 | C3.- 37.2,42.34 | 38.73,38.1 R6.1 | 38.73,38.1 38.1,37.46 R4.2 | LED1.C 19.46,57.56 19.05,57.15 19.05,55.24 v18.41,54.61 | R10.2 80.92,18.78 80.01,19.69 C10.- 77.47,19.52 v77.47,17.78 | C5.- 76.83,40.13 76.83,38.1 77.47,37.46 JP7.1 77.47,31.75 | R8.2 67.17,15.24 67.94,15.24 68.17,15.47 v68.17,16.51 | R5.2 39.64,19.41 39.37,19.69 C7.- | R3.2 63.5,38.77 63.5,42.23 63.18,42.54 C4.- | C8.- 82.04,37.97 82.55,37.46 JP7.3 | C1.- 87.12,37.97 87.63,37.46 JP7.5 | Q3.S C2.2 | 38.73,38.1 38.73,39.69 40.01,40.96 40.01,48.89 41.59,50.48 47.62,50.48 48.9,51.75 48.9,54.29 v47.94,55.24
  Top 0.61: U$8.GND 90.17,30.48 88.9,31.75 77.47,31.75 76.2,31.75 74.93,30.48 U$8.GND@0 | U$9.2 | U$9.2 97.63,16.19 U1.GND@4 U1.GND@3 93.98,6.98 U$3.7 | U$3.7 | D2.A 31.11,8.26 31.75,7.62 32.7,7.62 33.97,6.35 33.97,3.56 S1.1 33.3,1.63 33.66,1.27 40.32,1.27 | 40.96,1.27 40.96,1.9 | 40.96,1.9 40.96,6.67 40.64,6.98 U1.GND@0 | 40.32,1.27 40.96,1.27 | 57.78,44.45 57.95,43.02 C4.- 57.95,44.29 v58.1,44.45 | v57.15,17.78 57.31,17.94 C9.- | 40.96,1.27 41.59,1.27 | 41.59,1.27 SER1.1 | SER1.1 | 40.32,1.27 40.96,1.9 | 40.96,1.9 41.59,1.27 | C6.- 35.72,27.46 34.29,26.03 U$6.GND@0 | U$6.GND@0
  Top 0.813: C3.- 36.99,44.29 35.56,45.72 34.29,45.72 33.66,46.35 U$4.GND@0 | C9.- 57.31,20.8 54.61,23.49 U$7.GND@0 | 23.18,0.95 25.4,3.17 D2.A
  Top 0.914: 11.75,0.95 23.18,0.95
  Top 1.016: C7.- 36.99,20.8 34.29,23.49 U$6.GND@0 | U$8.GND@0 74.93,23.81 77.47,21.27 77.47,19.84 C10.- | U$5.GND@0 54.61,46.35 56.52,44.45 57.78,44.45 | 11.75,0.95 9.21,0.95 7.3,2.86 7.3,5.08
  Top 1.27: 4.45,15.24 7.14,15.24 | Q3.S 18.73,36.51 16.51,38.73 6.35,38.73 2.54,34.92 2.54,24.77
  Top 1.422: 2.54,24.77 2.54,17.14 4.45,15.24 2.54,13.33 2.54,5.71 3.33,4.92 X4.4 | 7.14,15.24 X4.2
  Bottom 0.305: 30.48,49.53 v30.48,51.43 | v18.41,54.61 17.78,54.61 17.14,53.97 11.43,53.97 10.16,52.7 10.16,49.05 | 77.47,35.24 JP7.1 77.47,36.2 82.55,36.2 | v68.17,16.51 76.2,16.51 v77.47,17.78 | 82.55,36.2 JP7.3 | 82.55,36.2 87.63,36.2 JP7.5 | v47.94,55.24 47.94,54.93 47.62,54.61 | Z+.2
  Bottom 0.61: I2C.2 Z+.2 Z-.2 Y+.2 Y-.2 X+.2 X-.2 71.28,47.62 U$5.GND 69.85,52.7 67.94,54.61 57.15,54.61 55.88,53.34 55.88,51.12 54.13,49.37 | U1.GND@0 U1.GND@1 | SER2.1 SER3.1 SER4.1 55.24,1.27 55.88,0.63 59.05,0.63 60.33,1.9 SERIAL.2 A-OUT.2 60.33,4.92 61.75,6.35 71.91,6.35 U$10.2 73.18,4.13 73.18,3.97 71.75,2.54 71.75,1.27 72.39,0.63 87.63,0.63 91.12,4.13 U$3.7 | SER2.1 | SER1.1 SER2.1
  Bottom 0.813: 20.48,43.97 20.32,43.81 | 54.61,48.89 U$5.GND@0 | 22.23,1.59 25.4,4.44 D2.A
  Bottom 0.914: 22.23,1.59 11.43,1.59 | 7.62,5.08 7.46,5.08 X4.4 | 33.66,48.89 U$4.GND@0 | 48.9,49.37 U$4.GND | 20.8,49.05 21.43,49.05 | 22.23,48.58 20.8,49.37 | U$6.GND@0
  Bottom 1.016: 74.93,22.86 U$8.GND@0 | 69.85,22.86 U$7.GND | 54.61,22.86 U$7.GND@0 | U$6.GND | 49.53,22.86 U$6.GND | 34.92,22.86 34.29,23.49 U$6.GND@0 34.29,19.69 29.84,15.24 12V-AUX.2 28.57,11.43 D2.A | 2.86,28.89 2.86,17.3 5.08,15.08 | 11.43,1.59 8.89,1.59 7.3,3.17 X4.4
  Bottom 1.27: 8.89,41.27 11.59,43.97 20.48,43.97 Q2.S | 34.92,22.86 49.53,22.86 54.61,22.86 69.85,22.86 74.93,22.86 | 33.66,48.89 33.02,49.53 31.75,49.53 37.47,55.24 46.99,55.24 47.62,54.61 48.9,53.34 48.9,49.37 54.13,49.37 54.61,48.89 | 6.35,38.73 16.51,38.73 18.73,36.51 Q3.S | Q1.S 20.98,51.4 20.98,49.27
  Bottom 1.422: 31.75,49.53 30.48,49.53 29.53,49.53 28.57,48.58 22.23,48.58 21.59,48.58 20.8,49.05 10.16,49.05 8.89,49.05 7.62,47.78 7.62,40 | 7.62,40 6.35,38.73 2.54,34.92 2.54,17.14 4.45,15.24 | 7.62,40 8.89,41.27 | 4.45,15.24 4.6,15.08 5.08,15.08 X4.2 | 6.99,5.08 3.17,5.08 2.54,5.71 2.54,13.33 4.45,15.24
  Bottom 1.676: U$6.GND@0
  pour Bottom: 0.32,0.95 0.32,59.05 1.27,60.01 44.45,60.01 44.45,46.99 33.66,46.99 33.02,48.26 31.75,49.53 30.48,49.53 27.94,46.99 27.94,35.88 16.83,35.88 15.24,34.29 11.75,34.29 10.48,33.02 10.48,29.84 11.43,28.89 11.43,28.57 9.53,26.67 9.53,23.49 5.71,23.49 3.81,21.59 3.81,19.05 5.08,17.78 8.89,17.78 15.88,10.79 15.88,8.26 16.51,7.62 12.7,7.62 12.06,8.26 12.06,10.79 10.79,12.06 5.71,12.06 3.81,10.16 3.81,9.53 5.71,7.62 6.99,7.62 11.43,3.17 22.23,3.17 22.23,0.32 0.95,0.32
  pour Bottom: 19.05,0.32 18.73,2.86 22.23,3.17 24.77,5.71 24.77,10.79 23.5,12.06 20.95,12.06 20.95,13.97 19.68,15.24 20.32,15.87 21.59,14.6 26.67,14.6 27.94,15.87 29.21,15.87 30.48,17.14 30.48,18.41 28.57,20.32 27.94,20.32 25.4,22.86 20.32,22.86 15.24,27.94 19.37,32.07 22.54,32.07 23.81,33.34 23.81,34.61 22.86,35.56 23.18,35.56 23.81,36.2 26.04,45.09 27.94,45.09 29.21,43.81 30.48,43.81 31.11,44.45 50.16,44.45 50.16,34.29 29.21,34.29 27.94,33.02 27.94,31.11 29.84,29.21 36.83,29.21 38.1,30.48 47.62,30.48 50.16,27.94 50.16,26.67 50.8,26.03 50.8,0.32
  pour Bottom: 40.01,60.01 100.33,60.01 101.28,59.05 101.28,46.35 71.12,46.35 71.12,33.02 69.22,33.02 67.94,34.29 48.26,34.29 48.26,44.45 52.07,44.45 53.34,45.72 53.34,48.26 52.7,48.89 50.8,48.89 50.16,48.26 50.16,47.62 49.53,46.99 40.01,46.99
  pour Bottom: 47.62,0.32 47.62,27.3 50.16,27.3 50.16,26.67 50.8,26.03 50.8,24.13 51.44,23.49 52.7,23.49 53.34,24.13 53.34,25.4 58.42,30.48 67.94,30.48 70.48,27.94 70.48,24.77 71.75,23.49 73.66,23.49 74.3,24.13 74.3,28.57 71.75,31.11 71.75,43.18 72.39,43.81 73.66,43.81 74.3,44.45 91.44,44.45 92.71,45.72 101.28,45.72 101.28,0.95 100.65,0.32
  pour Top: 0.32,0.95 0.32,59.05 1.27,60.01 100.33,60.01 101.28,59.05 101.28,46.35 87.63,46.35 87,46.99 74.93,46.99 73.66,45.72 73.66,43.81 70.48,43.81 70.48,39.37 53.98,39.37 56.2,41.59 56.83,41.59 57.15,41.91 57.15,43.18 53.98,46.35 53.98,48.89 53.34,49.53 50.8,49.53 50.8,39.37 43.18,39.37 36.83,33.02 36.2,33.02 34.92,34.29 30.48,34.29 29.84,34.92 29.84,39.37 30.48,40 33.66,40 34.92,41.27 34.92,45.09 33.02,46.99 33.02,48.26 31.75,49.53 29.84,49.53 26.67,46.35 26.67,43.18 26.35,42.86 20,42.86 19.37,43.5 19.37,45.4 15.88,48.89 13.34,48.89 10.79,46.35 10.79,41.91 11.43,41.27 15.24,40.96 18.41,37.78 21.59,37.78 22.23,37.15 22.23,36.83 21.27,35.88 16.83,35.88 16.51,36.2 16.51,36.51 15.24,37.78 11.75,37.78 8.89,34.92 8.89,29.53 10.48,27.94 9.53,26.99 9.53,23.49 5.71,23.49 3.81,21.59 3.81,19.05 5.08,17.78 8.89,17.78 15.88,10.79 15.88,7.62 12.7,7.62 12.06,8.26 12.06,10.79 10.79,12.06 5.71,12.06 3.81,10.16 3.81,9.53 5.71,7.62 6.99,7.62 11.43,3.17 22.23,3.17 24.77,5.71 25.4,5.71 25.4,0.32 0.95,0.32
  pour Top: 37.47,34.29 70.48,34.29 70.48,45.09 59.37,45.09 57.78,40.32 50.48,37.46 50.8,48.26 46.35,48.26 45.72,47.62 37.47,47.62
  pour Top: 47.94,0.32 47.62,16.51 69.22,16.51 69.22,17.14 69.85,17.78 71.12,16.51 101.6,16.51 101.28,0.95 100.65,0.32
  pour Top: 24.77,0.32 24.77,10.79 23.5,12.06 20.95,12.06 20.95,13.97 19.68,15.24 20.95,16.51 22.86,14.6 26.67,14.6 27.94,15.87 29.84,15.87 34.29,20.32 34.29,28.57 36.83,31.11 36.83,32.38 38.1,33.65 71.12,33.65 71.12,43.18 74.3,43.18 74.3,45.09 74.93,45.72 101.28,45.72 101.28,13.97 75.56,13.97 75.56,22.23 74.3,23.49 74.3,25.72 73.03,26.99 72.39,26.99 71.12,25.72 71.12,22.23 69.85,20.95 69.85,13.97 54.61,13.97 54.61,22.23 53.34,23.49 53.34,25.4 52.7,26.03 50.8,26.03 50.8,24.13 48.9,22.23 48.9,0.32
LED
  Top 0.305: U1.D13 28.96,57.53 27.94,56.51 26.04,56.51 25.4,55.88 25.4,54.88 R12.2
MISO
  Bottom 0.305: U1.D50 95.25,18.41 95.25,16.67 94.46,15.87 93.34,15.87 92.71,15.24 92.71,6.98 93.66,6.03 95.25,6.03 U$3.3
MOSI
  Bottom 0.305: U$3.4 97.94,3.33 100.01,3.33 100.42,3.73 100.42,5.63 100.01,6.03 100.01,10.79 97.71,13.09 97.71,18.49 U1.D51
N$1
  Top 0.305: LED3.C 2.54,53.97 3.17,53.34 10.16,53.34 10.79,52.7 10.79,41.91 11.43,41.27 U$2.P$4
  Bottom 1.27: Q2.D 23.5,42.86 21.91,41.27 U$2.P$4
N$3
  Bottom 1.422: U$4.2B E0-MOT.1
N$4
  Bottom 1.422: U$4.2A E0-MOT.2
N$5
  Top 0.305: R6.2 42.91,40.27 JP2.1
  Bottom 0.305: U$4.MS1 34.29,34.92 39.37,40 40.64,40 JP2.1
N$6
  Bottom 0.305: U$4.MS3 42.55,38.73 44.45,38.73 JP2.5
N$7
  Top 0.305: LED4.C 5.08,55.24 6.35,53.97 12.06,53.97 12.7,53.34 12.7,52.07 U$2.P$6
  Bottom 1.27: 23.65,52.23 Q1.D 23.34,52.86 22.07,54.13 20.16,54.13 18.57,52.55 14.45,52.55 U$2.P$6
N$8
  Bottom 0.406: U$4.RST U$4.SLP
N$9
  Bottom 0.305: U$4.MS2 36.2,35.56 40.01,39.37 42.55,39.37 JP2.3
N$10
  Bottom 1.422: U$4.1A E0-MOT.3
N$11
  Bottom 1.422: U$4.1B E0-MOT.4
N$12
  Bottom 1.422: U$5.2B E1-MOT.1
N$13
  Bottom 1.422: U$5.2A E1-MOT.2
N$14
  Top 0.305: R5.1 41.91,15.51 JP4.1
  Bottom 0.305: U$6.MS1 35.56,13.33 36.83,13.33 JP4.1
N$15
  Bottom 0.305: U$6.MS2 38.1,13.33 39.37,13.33 JP4.3
N$16
  Bottom 1.422: U$5.1A E1-MOT.3
N$17
  Bottom 0.305: U$7.MS2 57.15,12.7 61.59,17.14 63.5,17.14 JP5.3
N$18
  Bottom 1.422: U$5.1B E1-MOT.4
N$19
  Bottom 0.305: U$6.MS3 40.64,13.33 41.91,13.33 JP4.5
N$20
  Bottom 0.305: U$6.RST U$6.SLP
N$21
  Bottom 1.422: U$6.2B X-MOT.1
N$22
  Bottom 1.422: U$6.2A X-MOT.2
N$23
  Bottom 0.406: U$7.RST U$7.SLP
N$24
  Bottom 0.406: U$5.RST U$5.SLP
N$25
  Top 0.305: U$5.MS1 55.88,36.2 58.1,36.2 60.26,38.35 R3.1 62.23,39.5 JP3.1
N$26
  Bottom 1.422: U$6.1A X-MOT.3
N$27
  Bottom 1.422: U$6.1B X-MOT.4
N$28
  Bottom 1.422: U$7.2B Y-MOT.1
N$29
  Bottom 1.422: U$7.2A Y-MOT.2
N$30
  Bottom 1.422: U$7.1A Y-MOT.3
N$31
  Bottom 0.305: U$7.MS3 60.33,12.06 66.67,18.41 JP5.5
N$32
  Top 0.305: R23.2 26.4,33.92 LED2.A
N$33
  Top 0.305: R8.1 65.1,15.54 JP5.1
  Bottom 0.305: U$7.MS1 55.24,12.06 61.59,18.41 JP5.1
N$34
  Top 0.305: JP3.5 67.31,39.37 64.45,36.51 61.28,36.51 U$5.MS3
N$35
  Top 0.305: JP3.3 64.77,37.78 64.14,37.15 60.01,37.15 58.42,35.56 58.42,35.24 58.1,34.92 U$5.MS2
N$36
  Bottom 1.422: U$7.1B Y-MOT.4
N$37
  Bottom 0.305: U$8.MS2 78.11,12.06 82.55,16.51 84.45,16.51 85.09,17.14 JP6.3
N$38
  Top 0.305: U$8.RST U$8.SLP
N$39
  Bottom 0.305: U$8.MS3 80.01,12.7 82.55,15.24 84.45,15.24 JP6.5
N$40
  Top 0.305: JP6.1 82.55,17.14 83.19,16.51 83.19,15.51 R10.1
  Bottom 0.305: U$8.MS1 75.56,12.06 76.83,13.33 78.11,13.33 82.55,17.78 JP6.1
N$41
  Bottom 1.422: U$8.2B Z-MOT1.1 Z-MOT.1
N$42
  Bottom 1.422: U$8.2A Z-MOT1.2 Z-MOT.2
N$43
  Bottom 1.422: U$8.1A Z-MOT1.3 Z-MOT.3
N$44
  Bottom 1.422: U$8.1B Z-MOT1.4 Z-MOT.4
N$45
  Top 0.305: R24.2 10.16,58.42 9.53,59.05 3.17,59.05 2.54,58.42 LED3.A
N$46
  Top 0.305: R12.1 22.23,54.61 21.59,55.24 20.7,55.24 LED1.A
N$47
  Top 0.305: R14.2 29.84,50.16 26.04,46.35 Q2.G | Q2.G
N$48
  Top 0.305: R13.2 27.73,53.76 26.04,52.07 26.04,51.28 Q1.G
N$49  (via drill 0.6)
  Top 0.305: R15.2 30.9,38.95 v30.48,39.37
  Bottom 0.305: v30.48,39.37 30.48,36.83 25.08,31.43 Q3.G
N$50
  Top 0.305: R25.2 5.13,57.51 LED4.A
N$51
  Top 0.305: LED2.C 21.91,33.97 21.59,33.65 21.27,33.65 Q3.D
  Top 1.27: U$2.P$2 15.24,31.11 18.1,33.97 Q3.D
  Bottom 1.27: U$2.P$2 15.24,31.11 18.1,33.97 Q3.D
  pour Top: 11.43,32.7 11.43,30.8 12.06,30.16 16.19,30.16 18.73,32.7 20.95,32.7 21.59,33.34 21.59,34.61 20.95,35.24 16.83,35.24 15.24,33.65 12.38,33.65
  pour Bottom: 11.11,33.02 11.11,29.84 12.06,28.89 15.24,28.89 19.05,32.7 22.54,32.7 23.18,33.34 23.18,34.61 22.54,35.24 16.83,35.24 15.24,33.65 11.75,33.65
N$53
  Top 1.27: X4.1 7.46,20.32 9.53,20.32 18.89,10.95 F2.1
  Bottom 1.422: 9.53,20.32 7.62,20.32 | 9.53,20.32 19.05,10.79 19.05,8.89 | 9.53,20.32 9.37,20.16 X4.1
  pour Bottom: 4.45,21.59 4.45,19.05 5.08,18.41 8.89,18.41 16.51,10.79 16.51,8.26 17.14,7.62 19.68,7.62 20.32,8.26 20.32,13.33 18.41,15.24 17.78,15.24 10.16,22.86 5.71,22.86
  pour Top: 4.45,21.59 4.45,19.05 5.08,18.41 8.89,18.41 16.51,10.79 16.51,8.26 17.14,7.62 19.68,7.62 20.32,8.26 20.32,13.33 18.41,15.24 17.78,15.24 10.16,22.86 5.71,22.86
N$54
  Top 1.27: X4.3 8.41,10 14.61,4.44 20.32,4.44 22.23,5.71 22.23,8.1 F1.2
  Bottom 1.422: 7.62,10.16 8.26,10.16 13.34,4.44 20.32,4.44 22.23,5.71 22.23,8.26
  pour Bottom: 4.45,10.16 4.45,9.53 5.71,8.26 6.99,8.26 11.43,3.81 22.23,3.81 24.13,5.71 24.13,10.79 23.5,11.43 21.59,11.43 20.95,10.79 20.95,6.98 19.68,5.71 17.78,5.71 16.51,6.98 12.7,6.98 11.43,8.26 11.43,10.79 10.79,11.43 5.71,11.43
  pour Top: 4.45,10.16 4.45,9.53 5.71,8.26 6.99,8.26 11.43,3.81 22.23,3.81 24.13,5.71 24.13,10.79 23.5,11.43 21.59,11.43 20.95,10.79 20.95,6.98 19.68,5.71 17.78,5.71 16.51,6.98 12.7,6.98 11.43,8.26 11.43,10.79 10.79,11.43 5.71,11.43
RESET
  Top 0.305: S1.2 37.82,3.45 37.47,3.81 37.47,5.71 33.66,9.53 U1.RES
SCK
  Bottom 0.305: U1.D52 93.82,16.99 93.34,16.99 91.6,15.24 91.6,11.43 90.17,10.32 90.17,7.94 93.5,4.6 U$3.5
SCL
  Top 0.305: R22.1 92.71,39 92.71,52.7 89.69,55.72 I2C.4
  Bottom 0.305: I2C.4 87.47,57.79 U1.D21
SDA
  Top 0.305: R21.1 91.44,45.09 90.81,45.72 90.81,51.43 89.53,52.7 I2C.3
  Bottom 0.305: I2C.3 86.52,56.2 85.72,56.2 84.14,57.79 U1.D20
THERM0
  Top 0.305: U1.A13 87.63,10.79 88.42,10.79 88.9,11.27 88.9,13.33 91.44,15.87 91.44,31.11 89.69,32.86 80.8,32.86 80.01,33.65 JP7.2 80.01,42.54 78.74,43.81 77.01,43.81 C5.+ 76.25,43.86 75.56,43.18 75.56,39.75 R7.1
THERM1
  Top 0.305: U1.A14 90.17,10.79 91.44,10.79 92.08,11.43 92.08,31.75 90.17,33.65 85.57,33.65 85.09,34.13 JP7.4 85.09,42.54 83.82,43.81 82.09,43.81 C8.+ 82.04,45.59 81.92,45.72 75.56,45.72 74.93,45.09 74.93,40.64 74.3,40 73.6,40 R1.1
THERM2
  Top 0.305: U1.A15 92.71,10.79 92.71,32.38 JP7.6 | JP7.6 90.01,35.08 | R11.1 74.3,43.61 74.3,45.72 74.93,46.35 86.36,46.35 87.12,45.59 C1.+ 87.17,43.81 88.9,43.81 90.17,42.54 JP7.6
VCC  (via drill 0.6)
  Top 0.305: R18.1 35.56,14.33 35.56,11.43 37.47,9.53 U1.5V@0 | R22.2 R21.2 89.53,44.72 I2C.1 | R20.1 75.93,13.6 76.2,13.33 76.2,11.43 74.93,10.16 74.93,3.17 73.82,2.06 U$10.1 | R19.1 61.96,14.97 60.33,13.33 59.05,13.33 58.42,12.7 58.42,11.43 57.15,10.16 57.15,4.6 A-OUT.1 | X-.3 74.14,48.1 v71.12,45.09 71.12,44.35 71.39,44.09 R11.2 R1.2 R7.2 71.39,36.56 73.34,34.61 v73.34,32.07 | R17.1 57.78,37.46 59.69,39.37 v59.69,40.64 | R16.1 47.99,40.05 48.26,40.32 48.26,42.54 JP2.6 46.99,45.09 46.35,45.72 U$4.VDD
  Top 0.406: JP6.2 JP6.4 JP6.6 U$8.VDD | JP4.2 JP4.4 JP4.6 U$6.VDD | JP2.2 JP2.4 JP2.6 | X-.3 73.18,49.21 68.9,49.21 U$5.VDD | JP5.6 U$7.VDD | 47.62,38.73 47.62,38.46 R16.1 46.4,36.51 45.72,36.51 45.09,35.88 45.09,33.97 46.04,33.02 49.21,33.02 51.44,30.8 51.44,29.21 49.53,27.3 48.58,27.3 46.99,25.72 U$6.VDD | U$6.VDD
  Top 0.559: U$9.1 100.33,13.33 100.33,7.78
  Top 0.61: 100.33,7.78 99.22,6.67 U$3.1 100.97,2.86 100.97,1.27 100.33,0.63 74.93,0.63 73.66,1.9 U$10.1 72.23,0.63 59.21,0.63 SERIAL.1
  Bottom 0.305: X-.3 74.3,47.78 | 38.1,20.95 30.48,13.33 30.48,11.43 31.11,10.79 36.83,10.79 U1.5V@0 | U$8.VDD 87.63,26.03 89.53,27.94 89.53,30.16 87.95,31.75 74.61,31.75 74.3,32.07 v73.34,32.07 | v71.12,45.09 68.58,45.09 JP3.6 JP3.4 JP3.2 61.28,42.86 60.64,42.86 59.69,41.91 v59.69,40.64 | I2C.1
  Bottom 0.406: I2C.1 Z+.3 Z-.3 Y+.3 Y-.3 X+.3 X-.3 | U1.5V@2 U1.5V@1 91.44,55.24 91.44,50.16 89.53,48.26 | JP6.2 JP5.6 JP5.4 JP5.2 JP4.6 | 38.1,20.95 JP4.2
  Bottom 0.61: I2C.1 89.53,48.26 | SERIAL.1 A-OUT.1 54.45,4.6 51.12,7.94 39.69,7.94 U1.5V@0 38.1,8.89 37.47,8.26 37.47,7.62 30.48,7.62 29.53,6.67 VCC.1
X-DIR
  Bottom 0.305: U$6.DIR U1.A1
X-EN
  Top 0.305: R18.2 31.75,13.06 U$6.EN
  Bottom 0.305: U1.D38 93.98,34.29 92.71,33.02 92.71,32.38 | 92.71,32.38 92.71,32.07 | 92.71,32.38 90.65,30.32 90.65,27.78 88.9,26.03 88.9,20.32 88.27,19.69 38.1,19.69 31.75,13.33 U$6.EN | U$6.EN
X-MAX
  Bottom 0.305: X+.1 76.83,53.66 75.41,55.09 70.33,55.09 69.06,56.36 59.85,56.36 U1.D2
X-MIN
  Bottom 0.305: X-.1 74.3,54.13 73.98,54.45 70.01,54.45 68.74,55.72 57.94,55.72 U1.D3
X-STEP
  Bottom 0.305: U$6.STEP U1.A0
Y-DIR
  Bottom 0.305: U1.A7
  Bottom 0.406: U1.A7 68.58,10.79 U$7.DIR
Y-EN
  Top 0.305: U1.A2 55.88,12.7 58.42,15.24 R19.2
  Bottom 0.305: U$7.EN U1.A2
Y-MAX
  Bottom 0.305: Y+.1 81.92,53.66 79.22,56.36 72.55,56.36 U1.D15
Y-MIN
  Bottom 0.305: Y-.1 79.38,53.66 77.31,55.72 70.64,55.72 U1.D14
Y-STEP
  Bottom 0.305: U1.A6
  Bottom 0.406: U1.A6 66.04,10.79 U$7.STEP
Z-DIR
  Bottom 0.305: U$8.DIR 90.17,14.92 92.71,17.46 92.71,20.95 U1.D48
Z-EN
  Top 0.305: U1.A8 72.39,10.79 U$8.EN 73.93,13.6 R20.2
Z-MAX
  Bottom 0.305: Z+.1 87,53.97 84.61,56.36 82.71,56.36 U1.D19
Z-MIN
  Bottom 0.305: Z-.1 84.45,53.66 81.76,56.36 80.17,56.36 U1.D18
Z-STEP
  Bottom 0.305: U$8.STEP 87.63,13.65 92.08,18.1 92.08,21.59 92.71,22.23 92.71,22.86 93.82,23.97 93.82,24.61 U1.D46
(copper drawn outside any net)
  shapes: Bottom circle x1

### Text on the board
tNames: 2B | 2A | 1A | 1B | 2B | 2A | 1A | 1B | 9 | 10 | MS1 | MS2 | MS3 | MS1 | MS3 | 8 | 2B | 2A | 1A | 1B | 2B | 2A | 1A | 1B | 2B | 2A | 1A | 1B | MS2 | MS1 | MS3 | MS2 | MS1 | MS3 | MS2 | MS1 | MS3 | 11A+ | 5A | GND | 8 | RESET | 1 | 1
bNames: + | + | + | +
Document: RAMPS 1.4 (RepRap Arduino MEGA Pololu Shield) | GPL v3 | reprap.org/wiki/RAMPS1.4 | Reversing input power, and inserting stepper drivers incorrectly will destroy electronics. | I2C | 21 | 20 | 12-35V Out | GND | 5V | - | D10 | + | AUX-4 | D16 | - | D17 | D9 | + | D23 | D25 | - | D11 | D27 | + | D29 | D31 | 12-35VDC In | D33 | + | D35 | 11A | D37 | - | D38 | D41 | + | 5A | D43 | - | D45 | SERVOS | AUX-1 | AUX-2 | AUX-3 / SPI | D11 | D6 | D5 | D4 | D47 | A9 | A11 | SCK | MISO | D32 | 5V | GND | D2 | D1 | GND | D63 | D48 | D42 | D65 | GND | D52 | D50 | 5V | 5V | 5V | 5V | 5V | GND | 5V | GND | A3 | A4 | 5V | A5 | A10 | D44 | A12 | NC | D53 | MOSI | D49 | D57 | D58 | D59 | D64 | D66 | D51 | 5V | GND | GND | GND | GND | Copyright 2011 Johnny Russell - UltiMachine
_tsilk: + | I2C | END STOPS | 21 | + | E0 | 1 | S | 20 | D10 | 1 | - | - | E1 | + | + | + | D9 | T0 | T1 | T2 | + | 1 | + | D8 | 1 | 1 | 1 | U | X | Y | Z | + | + | - | 1 | + | PS | AUX-4 | AUX-1 | AUX-2 | AUX-3 | + | - | s | s | 1 | - | + | UltiMachine | GPL3 | 1 | SERVOS | 1 | reprap.org/wiki/RAMPS | V1.4 | -